# EAGLE design BBC_Male (EAGLE 9.5.1)
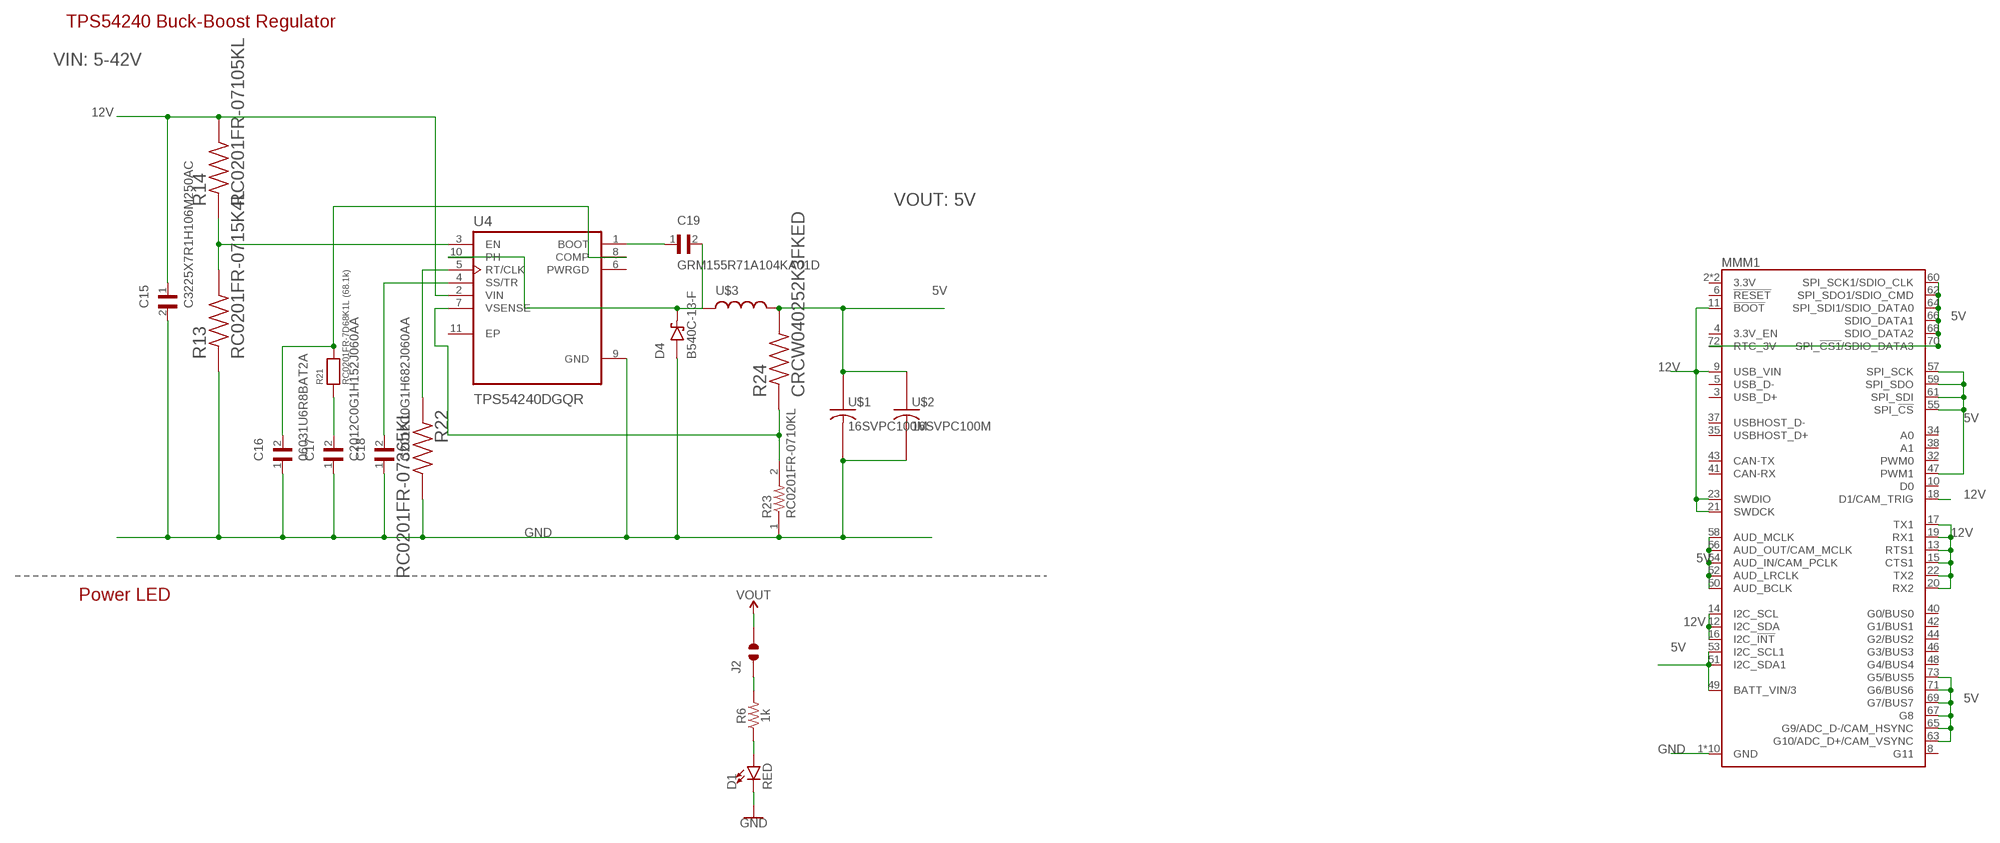
[diagram p0: schematic, sheet 1]

## Parts
C15  C3225X7R1H106M250AC  [CAPC3225X280N]
C16  06031U6R8BAT2A  [CAPC1507X91N]
C17  C2012C0G1H152J060AA  [CAPC2012X75N]
C18  C2012C0G1H682J060AA  [CAPC2012X75N]
C19  GRM155R71A104KA01D  [CAPC1005X55N]
D1  RED  LED-RED0603  [LED-0603]
D4  B540C-13-F  [DIOM6959X245N]
J2  JUMPER_SOLDER_1X2  [JUMPER_SOLDER_1X2]
MMM1  MICROMOD_4222_MALE  [MICROMOD_4222_MALE]
R6  1k  1KOHM-0603-1/10W-1%  [0603]
R13  RC0201FR-0715K4L  [RESC0603X26N]
R14  RC0201FR-07105KL  [RESC0603X26N]
R21  RC0201FR-7D68K1L (68.1k)  RESISTOR_0603  [_0603]
R22  RC0201FR-07365KL  [RESC0603X26N]
R23  RC0201FR-0710KL  [RESC0603X26N]
R24  CRCW040252K3FKED  [RESC1005X40N]
U4  TPS54240DGQR  [IC_XTR111AIDGQR]
U$1  16SVPC100M  [CAPAE0607X600N]
U$2  16SVPC100M  [CAPAE0607X600N]
U$3  MSS1260  [MSS1260]

## Nets
5V: J2.2 MMM1.47(PWM1) MMM1.49(BATT_VIN/3) MMM1.50(AUD_BCLK) MMM1.51(I2C_SDA1) MMM1.52(AUD_LRCLK) MMM1.53(I2C_SCL1) MMM1.54(AUD_IN/CAM_PCLK) MMM1.55(SPI_!CS!) MMM1.56(AUD_OUT/CAM_MCLK) MMM1.57(SPI_SCK) MMM1.58(AUD_MCLK) MMM1.59(SPI_SDO) MMM1.60(SPI_SCK1/SDIO_CLK) MMM1.61(SPI_SDI) MMM1.62(SPI_SDO1/SDIO_CMD) MMM1.63(G10/ADC_D+/CAM_VSYNC) MMM1.64(SPI_SDI1/SDIO_DATA0) MMM1.65(G9/ADC_D-/CAM_HSYNC) MMM1.66(SDIO_DATA1) MMM1.67(G8) MMM1.68(SDIO_DATA2) MMM1.69(G7/BUS7) MMM1.70(SPI_!CS1!/SDIO_DATA3) MMM1.71(G6/BUS6) MMM1.72(RTC_3V) MMM1.73(G5/BUS5) R24.2 U$1.+ U$2.+ U$3.P$1 ; supply symbol labelled VOUT
12V: C15.1 MMM1.9(USB_VIN) MMM1.11(!BOOT!) MMM1.12(I2C_SDA) MMM1.13(RTS1) MMM1.14(I2C_SCL) MMM1.15(CTS1) MMM1.16(I2C_!INT!) MMM1.17(TX1) MMM1.18(D1/CAM_TRIG) MMM1.19(RX1) MMM1.20(RX2) MMM1.21(SWDCK) MMM1.22(TX2) MMM1.23(SWDIO) R14.2 U4.2(VIN)
GND: C15.2 C16.1 C17.1 C18.1 D1.C D4.A MMM1.1(GND) MMM1.7(GND) MMM1.33(GND) MMM1.36(GND) MMM1.39(GND) MMM1.45(GND) MMM1.75(GND) MMM1.GND1(GND) MMM1.GND2(GND) MMM1.GND3(GND) R13.1 R22.2 R23.1 U4.9(GND) U$1.- U$2.-
N$8: J2.1 R6.2
N$9: D1.A R6.1
N$13: C19.1 U4.1(BOOT)
N$14: C17.2 R21.1
N$15: R13.2 R14.1 U4.3(EN)
N$16: C16.2 R21.2 U4.8(COMP)
N$17: R23.2 R24.1 U4.7(VSENSE)
N$18: C19.2 D4.C(K) U4.10(PH) U$3.P$2
N$19: C18.2 U4.4(SS/TR)
N$20: R22.1 U4.5(RT/CLK)
Unconnected: MMM1.2(3.3V) MMM1.3(USB_D+) MMM1.4(3.3V_EN) MMM1.5(USB_D-) MMM1.6(!RESET!) MMM1.8(G11) MMM1.10(D0) MMM1.32(PWM0) MMM1.34(A0) MMM1.35(USBHOST_D+) MMM1.37(USBHOST_D-) MMM1.38(A1) MMM1.40(G0/BUS0) MMM1.41(CAN-RX) MMM1.42(G1/BUS1) MMM1.43(CAN-TX) MMM1.44(G2/BUS2) MMM1.46(G3/BUS3) MMM1.48(G4/BUS4) MMM1.74(3.3V) U4.6(PWRGD) U4.11(EP)

## Notes on the sheet
- TPS54240 Buck-Boost Regulator
- VIN: 5-42V
- VOUT: 5V
- Power LED

## Library data of the parts
C15 = C3225X7R1H106M250AC:C3225X7R1H106M250AC: CAP CER 10UF 50V X7R 1210; DESCRIPTION: 10µF ±20% 50V Ceramic Capacitor X7R 1210 (3225 Metric); DIGI-KEY_PART_NUMBER: 445-14933-1-ND; MF: TDK; MP: C3225X7R1H106M250AC; PACKAGE: 1210 TDK; PURCHASE-URL: https://pricing.snapeda.com/search/part/C3225X7R1H106M250AC/?ref=eda
C16 = 06031U6R8BAT2A:06031U6R8BAT2A: CAP CER 6.8PF 100V NP0 0603; DESCRIPTION: 6.8pF ±0.1pF 100V Ceramic Capacitor C0G, NP0 0603 (1608 Metric); DIGI-KEY_PART_NUMBER: 478-06031U6R8BAT2ACT-ND; MF: AVX; MP: 06031U6R8BAT2A; PACKAGE: 1507 AVX; PURCHASE-URL: https://pricing.snapeda.com/search/part/06031U6R8BAT2A/?ref=eda
C17 = C2012C0G1H152J060AA:C2012C0G1H152J060AA: CERAMIC CAPACITOR 1500PF 50V, C0G, 5%, 0805; DESCRIPTION: 1500pF ±5% 50V Ceramic Capacitor C0G, NP0 0805 (2012 Metric); MF: TDK; MP: C2012C0G1H152J060AA; PACKAGE: 2012 TDK; PURCHASE-URL: https://pricing.snapeda.com/search/part/C2012C0G1H152J060AA/?ref=eda
C18 = C2012C0G1H682J060AA:C2012C0G1H682J060AA: Cap Ceramic 0.0068uF 50V C0G 5% Pad SMD 0805 125C T/R; AVAILABILITY: Unavailable; DESCRIPTION: 6800pF ±5% 50V Ceramic Capacitor C0G, NP0 0805 (2012 Metric); MF: TDK; MP: C2012C0G1H682J060AA; PACKAGE: 2012 TDK; PRICE: None
C19 = GRM155R71A104KA01D:GRM155R71A104KA01D; DESCRIPTION: SMD Capacitor X7R(EIA) with Capacitance: 0.10uF Tol. 10%. Rated Voltage: 10Vdc; DIGI-KEY_PART_NUMBER: 490-6321-1-ND; MF: Murata; MP: GRM155R71A104KA01D; PACKAGE: 1005 Taiyo Yuden; PURCHASE-URL: https://pricing.snapeda.com/search/part/GRM155R71A104KA01D/?ref=eda
D1 = SparkFun-LED:LED-RED: Assorted Red LEDs LilyPad 1206- DIO-09912 1206- DIO-00809 0603- DIO-00819 "SMART" means more efficient and expensive; PROD_ID: DIO-00819
D4 = B540C-13-F:B540C-13-F: Diode, Schottky, 5a, 40v, Do-214ab-2, Full Reel Check prices <https://pricing.snapeda.com/parts/B540C-13-F/Diodes%20Inc./view-part?ref=eda>; AVAILABILITY: Good; DESCRIPTION: Diode Schottky 40V 5A Surface Mount SMC; MF: Diodes Inc.; MP: B540C-13-F; PACKAGE: DO-214 Diodes Inc.; PRICE: None; PURCHASE-URL: https://pricing.snapeda.com/search/part/B540C-13-F/?ref=eda
J2 = dp_devices:JUMPER_SOLDER_1X2
MMM1 = Micromod_4222_Male:MICROMOD_4222_MALE
R6 = SparkFun-Resistors:1KOHM: 1kΩ resistor A resistor is a passive two-terminal electrical component that implements electrical resistance as a circuit element. Resistors act to reduce current flow, and, at the same time, act to lower voltage levels within circuits. - Wikipedia; PROD_ID: RES-07856
R13 = RC0201FR-0715K4L:RC0201FR-0715K4L: RC Series 0201 0.05 W 15.4 kOhms 1% ±200 ppm/°C SMT Thick Film Chip Resistor Check prices <https://pricing.snapeda.com/parts/RC0201FR-0715K4L/Yageo/view-part?ref=eda>; AVAILABILITY: Warning; DESCRIPTION: 15.4 kOhms ±1% 0.05W, 1/20W Chip Resistor 0201 (0603 Metric) Thick Film; MF: Yageo; MP: RC0201FR-0715K4L; PACKAGE: 0603 Rohm Semiconductor; PRICE: None
R14 = RC0201FR-07105KL:RC0201FR-07105KL: Res Thick Film 0201 105K Ohm 1% 1/20W ±200ppm/°C Molded SMD Paper T/R; DESCRIPTION: 105 kOhms ±1% 0.05W, 1/20W Chip Resistor 0201 (0603 Metric) Thick Film; DIGI-KEY_PART_NUMBER: 311-105KMCT-ND; MF: Yageo; MP: RC0201FR-07105KL; PACKAGE: 0603 Rohm Semiconductor
R21 = microbuilder:RESISTOR: Resistors 0402 - 0402 Surface Mount Package 22 Ohm 1% 1/16W [Digikey: 311-22.0LRTR-ND] 33 Ohm 5% 1/16W 1.0K 5% 1/16W 1.5K 5% 1/16W 2.0K 1% 1/16W 10.0K 1% 1/16W [Digikey: 311-10.0KLRTR-ND] 10.0K 5% 1/16W [Digikey: RMCF0402JT10K0TR-ND] 12.1K 1% 1/16W [Digikey: 311-22.0LRTR-ND] 100.0K 5% 1/16W 0603 - 0603 Surface Mount Package 0 Ohm 1/10 Watt 1% Resistor 15 Ohm 1/10 Watt 1% Resistor 33 Ohm 1/10 Watt 1% Resistor 49.9 Ohm 1/10 Watt 1% Resistor 100 Ohm 1/10 Watt 1% Resistor 150 Ohm 1/10 Watt 1% Resistor 240 Ohm 1/10 Watt 1% Resistor 390 Ohm 1/10 Watt 1% Resistor 560 Ohm 1/10 Watt 1% Resistor 680 Ohm 1/10 Watt 1% Resistor 750 Ohm 1/10 Watt 1% Resistor 1.0K Ohm 1/10 Watt 1% Resistor 1.5K Ohm 1/10 Watt 1% Resistor 2.0K Ohm 1/10 Watt 1% Resistor 2.2K Ohm 1/10 Watt 1% Resistor 3.3K Ohm 1/10 Watt 1% Resistor 4.7K Ohm 1/10 Watt 1% Resistor 10.0K Ohm 1/10 Watt 1% Resistor 12.0K Ohm 1/10 Watt 1% Resistor 12.1K Ohm 1/10 Watt 1% Resistor 20.0K Ohm 1/10 Watt 1% Resistor 33.0K Ohm 1/10 Watt 1% Resistor 100.0K Ohm 1/10 Watt 1% Resistor 0805 - 0805 Surface Mount Package 0 Ohm 1/8 Watt 1% Resistor 33 Ohm 1/8 Watt 1% Resistor 100 Ohm 1/8 Watt 1% Resistor 150 Ohm 1/8 Watt 1% Resistor 200 Ohm 1/8 Watt 1% Resistor 240 Ohm 1/8 Watt 1% Resistor 330 Ohm 1/8 Watt 1% Resistor 390 Ohm 1/8 Watt 1% Resistor 470 Ohm 1/8 Watt 1% Resistor 1.0K Ohm 1/8 Watt 1% Resistor 1.5K Ohm 1/8 Watt 1% Resistor 2.0K Ohm 1/8 Watt 1% Resistor 4.7K Ohm 1/8 Watt 1% Resistor 5.1K Ohm 1/8 Watt 1% Resistor 5.6K Ohm 1/8 Watt 1% Resistor 10.0K Ohm 1/8 Watt 1% Resistor 22.0K Ohm 1/8 Watt 1% Resistor 33.0K Ohm 1/8 Watt 1% Resistor 100K Ohm 1/8 Watt 1% Resistor 1206 - 1206 Surface Mount Package 2012 - 2010 Surface Mount Package 0.11 Ohm 1/2 Watt 1% Resistor - Digikey: RHM.11UCT-ND
R22 = RC0201FR-07365KL:RC0201FR-07365KL: RES SMD 365K OHM 1% 1/20W 0201; DESCRIPTION: 365 kOhms ±1% 0.05W, 1/20W Chip Resistor 0201 (0603 Metric) Moisture Resistant Thick Film; DIGI-KEY_PART_NUMBER: YAG2623CT-ND; MF: Yageo; MP: RC0201FR-07365KL; PACKAGE: 0603 Rohm Semiconductor; PURCHASE-URL: https://pricing.snapeda.com/search/part/RC0201FR-07365KL/?ref=eda
R23 = RC0201FR-0710KL:RC0201FR-0710KL: RC0201 10,0K 1% 0,05W TK200; DESCRIPTION: 10 kOhms ±1% 0.05W, 1/20W Chip Resistor 0201 (0603 Metric) Thick Film; DIGI-KEY_PART_NUMBER: 311-10.0KMCT-ND; MF: Yageo; MP: RC0201FR-0710KL; PACKAGE: 0201 Yageo; PURCHASE-URL: https://pricing.snapeda.com/search/part/RC0201FR-0710KL/?ref=eda
R24 = CRCW040252K3FKED:CRCW040252K3FKED: D10/Crcw0402 100 52K3 1% Et7 E3 Check prices <https://pricing.snapeda.com/parts/CRCW040252K3FKED/Vishay%20Dale/view-part?ref=eda>; AVAILABILITY: Warning; DESCRIPTION: Res Thick Film 0402 52.3K Ohm 1% 0.063W(1/16W) ±100ppm/C Molded SMD Automotive Paper T/R; MF: Vishay Dale; MP: CRCW040252K3FKED; PACKAGE: 1005 Panasonic Electronic Components; PRICE: None; PURCHASE-URL: https://pricing.snapeda.com/search/part/CRCW040252K3FKED/?ref=eda
U4 = TPS54240DGQR:TPS54240DGQR: Check prices <https://pricing.snapeda.com/parts/TPS54240DGQR/Texas%20Instruments/view-part?ref=eda>; AVAILABILITY: Good; DESCRIPTION: 3.5V to 42V Input, 2.5A Step-Down Converter with Eco-Mode 10-HVSSOP -40 to 125; MF: Texas Instruments; MP: TPS54240DGQR; PACKAGE: HVSSOP-10 Texas Instruments; PRICE: None; PURCHASE-URL: https://pricing.snapeda.com/search/part/TPS54240DGQR/?ref=eda
U$1 U$2 = 16SVPC100M:16SVPC100M: CAP POLYMER 100UF 20% 16V SMD; DESCRIPTION: 100µF 16V Aluminum - Polymer Capacitors Radial, Can - SMD 24mOhm 2000 Hrs @ 105°C; DIGI-KEY_PART_NUMBER: P16468CT-ND; MF: Panasonic; MP: 16SVPC100M; PACKAGE: Radial Panasonic; PURCHASE-URL: https://pricing.snapeda.com/search/part/16SVPC100M/?ref=eda
U$3 = inductor-coilcraft (1):MSS1260: SMT Power Inductor

## Board
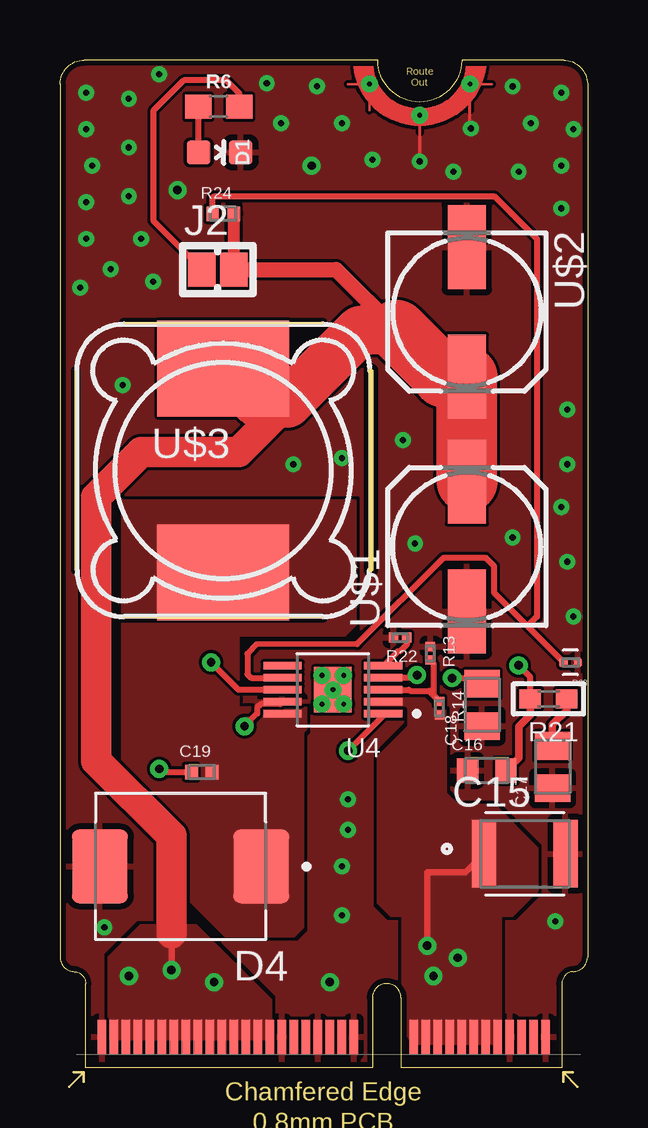
[diagram p1: board, top side]
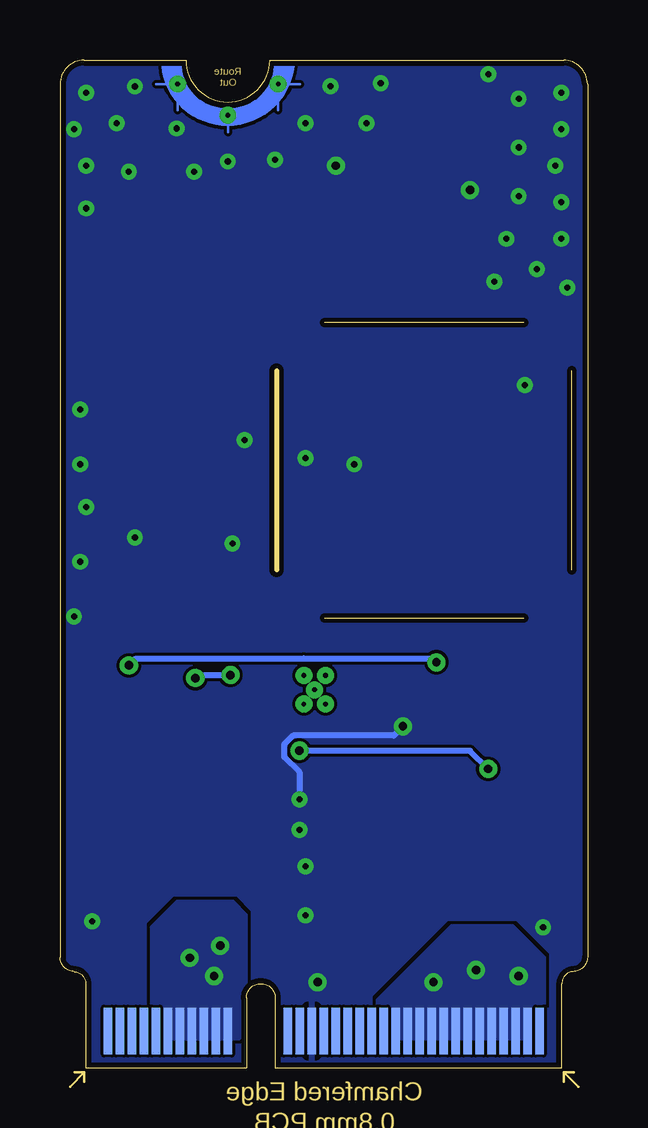
[diagram p2: board, bottom side, seen from below]

Size 22 x 42 mm. Coordinates in mm from the lower left corner, seen from the top.
Copper layers (1*16): Top 0.075mm / dielectric 1.6mm / Bottom 0.075mm
Design rules "jlcpcb-2layers *": minimum track width 8mil, minimum drill 0.2mm, track to track 5mil, track to pad 5mil, pad to pad 5mil, via to via 5mil, smd to smd 5mil, copper to edge 0.2mm, drill to drill 6mil, minimum pad ring 10mil, minimum via ring 8mil, stop-mask expansion 3mil, vias tented up to drill 0mil, thermal gap 10mil

### Footprints (pad centres in the part's own frame; a part is rotated, then mirrored left to right if it is on the bottom)
CAPC3225X280N = smd 1.01 x 2.81: 1 -1.7,0; 2 1.7,0
CAPC1507X91N = smd 0.89 x 1.02: 1 -0.796,0; 2 0.796,0
CAPC2012X75N = smd 1.15 x 1.47: 1 -0.88,0; 2 0.88,0
CAPC1005X55N = smd 0.54 x 0.6: 1 -0.432,0; 2 0.432,0
LED-0603 = smd 1 x 1: A 0,-0.877; C 0,0.877
DIOM6959X245N = smd 2.33 x 3.07: A 3.365,0; C -3.365,0
JUMPER_SOLDER_1X2 = smd 1.143 x 1.422: 1 -0.66,0; 2 0.66,0
MICROMOD_4222_MALE = smd 0.35 x 1.45: 1 9.25,1.275; 3 8.75,1.275; 5 8.25,1.275; 7 7.75,1.275; 9 7.25,1.275; 11 6.75,1.275; 13 6.25,1.275; 15 5.75,1.275; 17 5.25,1.275; 19 4.75,1.275; 21 4.25,1.275; 23 3.75,1.275; 33 1.25,1.275; 35 0.75,1.275; 37 0.25,1.275; 39 -0.25,1.275; 41 -0.75,1.275; 43 -1.25,1.275; 45 -1.75,1.275; 47 -2.25,1.275; 49 -2.75,1.275; 51 -3.25,1.275; 53 -3.75,1.275; 55 -4.25,1.275; 57 -4.75,1.275; 59 -5.25,1.275; 61 -5.75,1.275; 63 -6.25,1.275; 65 -6.75,1.275; 67 -7.25,1.275; 69 -7.75,1.275; 71 -8.25,1.275; 73 -8.75,1.275; 75 -9.25,1.275 | smd 0.35 x 1.95 bottom: 2 9,1.525; 4 8.5,1.525; 6 8,1.525; 8 7.5,1.525; 10 7,1.525; 12 6.5,1.525; 14 6,1.525; 16 5.5,1.525; 18 5,1.525; 20 4.5,1.525; 22 4,1.525; 32 1.5,1.525; 34 1,1.525; 36 0.5,1.525; 38 0,1.525; 40 -0.5,1.525; 42 -1,1.525; 44 -1.5,1.525; 46 -2,1.525; 48 -2.5,1.525; 50 -3,1.525; 52 -3.5,1.525; 54 -4,1.525; 56 -4.5,1.525; 58 -5,1.525; 60 -5.5,1.525; 62 -6,1.525; 64 -6.5,1.525; 66 -7,1.525; 68 -7.5,1.525; 70 -8,1.525; 72 -8.5,1.525; 74 -9,1.525 | drill 0.2: GND1 1.9,41; GND2 4,39.7; GND3 6.1,41
0603 = smd 1.1 x 1: 1 -0.85,0; 2 0.85,0
RESC0603X26N = smd 0.38 x 0.4: 1 -0.281,0; 2 0.281,0
_0603 = smd 0.9 x 0.8: 1 -0.762,0; 2 0.762,0
RESC0603X26N' = smd 0.33 x 0.4: 1 -0.305,0 | smd 0.38 x 0.4: 2 0.28,0
RESC1005X40N = smd 0.51 x 0.6: 1 -0.445,0; 2 0.445,0
IC_XTR111AIDGQR = smd 1.6 x 0.3: 1 -2.1,1; 2 -2.1,0.5; 3 -2.1,0; 4 -2.1,-0.5; 5 -2.1,-1; 6 2.1,-1; 7 2.1,-0.5; 8 2.1,0; 9 2.1,0.5; 10 2.1,1 | smd 1.57 x 1.88: 11 0,0 | drill 0.2 pad 0.4: 12 -0.45,0.6; 13 0.45,0.6; 14 0,0; 15 -0.45,-0.6; 16 0.45,-0.6
CAPAE0607X600N = smd 3.5 x 1.6: + 2.7,0; - -2.7,0
MSS1260 = smd 5.5 x 4: P$1 0,4.25; P$2 0,-4.25

### Placement (x,y rotation side)
C15  19.38,8.91 0 top
C16  17.8,12.38 0 top
C17  20.54,12.53 90 top
C18  17.6,15.11 90 top
C19  5.92,12.32 0 top
D1  6.66,38.15 270 top
D4  5.03,8.38 180 top
J2  6.58,33.27 0 top
MMM1  11,0 0 top
R6  6.62,40.05 0 top
R13  15.45,17.27 270 top
R14  15.83,14.99 270 top
R21  20.37,15.37 180 top
R22  14.18,17.93 180 top
R23  RC0201FR-0710KL  [RESC0603X26N']  21.29,16.89 180 top
R24  6.81,35.59 0 top
U4  11.38,15.75 180 top
U$1  16.97,21.72 90 top
U$2  16.97,31.5 270 top
U$3  6.81,24.89 0 top

### Tracks (layer width: path | path; a pad name or v marks a point on that pad's centre or on a via)
5V  (via drill 0.35)
  Top 0.279: 4.65,5.59 v4.65,4.06
  Top 0.508: R24.2 J2.2
  Top 0.635: J2.2 11.51,33.27 14.05,30.73
  Top 1.27: 9.48,27.69 7.44,25.65 3.38,25.65 1.52,23.79 1.52,12.79 4.65,9.65 4.65,5.59
  Top 2.032: 14.05,30.73 12.52,30.73 9.48,27.69 8.26,27.69 U$3.P$1
  Top 2.54: 14.05,30.73 15.99,28.8 U$2.+ U$1.+
  other vias: 6.43,3.56 2.87,3.81
  pour Top (no thermals): 2.11,1.27 8.71,1.27 8.71,2.79 5.67,5.84 3.38,5.84 2.11,4.57
  pour Bottom (no thermals): 3.13,5.84 5.67,5.84 8.97,2.54 8.97,1.27 1.86,1.27 1.86,4.57
12V  (via drill 0.35)
  Top 0.279: C15.1 16.9,8.13 15.32,8.13 v15.32,5.08
  other vias: 16.59,4.57 15.57,3.81
  pour Top (no thermals): 13.03,15.37 15.19,15.37 16.08,14.48 16.08,11.43 16.59,10.92 18.11,10.92 19.89,9.14 19.89,7.37 18.87,6.35 13.79,6.35 13.29,6.86 13.29,12.95 14.56,14.22 14.56,14.99 14.43,15.11 13.03,15.11
  pour Top (no thermals): 16.08,14.35 16.08,14.86 15.57,14.86 15.57,14.35
  pour Top (no thermals): 14.3,6.86 14.3,1.52 14.81,1.02 18.11,1.02 18.37,1.27 18.37,6.86
  pour Bottom (no thermals): 14.3,6.35 14.3,1.52 14.56,1.27 18.11,1.27 18.11,5.84 17.1,6.86 14.81,6.86
GND  (via drill 0.25, 0.35)
  Top 0.127: MMM1.GND2 v15,37.77 | 17.1,39.18 MMM1.GND3
  Top 0.203: MMM1.GND2 | v17.13,39.14 17.1,39.18
  Top 0.254: U4.9 9.18,15.15 8.38,15.15 8.23,15 8.23,14.75 v7.7,14.22
  Bottom 0.254: v7.7,14.22 8.08,13.84 12.28,13.84 12.65,13.47 12.65,12.95 12.02,12.31 v12.02,11.18
  other vias: 20.91,40.64 21.41,39.12 20.91,37.59 20.91,35.81 18.87,40.89 19.64,39.37 19.13,37.34 16.41,37.35 13.03,37.85 11.76,39.37 10.72,40.91 9.22,39.37 8.62,41.03 4.14,41.4 2.87,40.39 2.87,38.35 1.09,39.12 1.09,40.64 2.87,36.32 3.38,34.54 3.89,32.77 1.35,37.59 1.09,36.07 1.09,34.54 2.11,33.27 0.84,32.51 21.16,27.43 21.16,25.15 14.3,26.16 11.76,25.4 14.81,21.84 18.87,22.1 12.02,9.91 11.76,8.38 11.76,6.35 9.73,25.15 2.62,28.45 20.91,23.37 21.16,21.08 21.41,18.8 20.65,6.1 1.86,5.84 10.49,37.59 4.9,36.58 11.25,3.56
  pour Top (rank 2): -0.43,42.42 22.43,42.42 22.43,-0.51 -0.43,-0.51
  pour Bottom (rank 2): -0.43,42.42 22.43,42.42 22.43,-0.51 -0.43,-0.51
N$8
  Top 0.254: R6.2 7.47,40.61 6.94,41.15 5.16,41.15 3.89,39.88 3.89,35.3 J2.1
N$9
  Top 0.254: D1.A R6.1
N$13  (via drill 0.35)
  Top 0.254: v4.14,12.45 4.27,12.32 C19.1 | v12.02,13.21 13.48,14.67 U4.1
  Bottom 0.254: v4.14,12.45 4.9,13.21 v12.02,13.21
N$14
  Top 0.305: R21.1 21.13,14.89 20.54,14.3 C17.2
N$15
  Top 0.254: R13.2 15.57,16.86 15.57,15.52 R14.1 15.39,15.7 14.59,15.7 14.54,15.75 U4.3
N$16  (via drill 0.35)
  Top 0.254: R21.2 19.61,16.28 v19.13,16.76 | U4.8 7.44,15.75 v6.3,16.89
  Top 0.305: R21.2 19.61,14.7 19.13,14.22 19.13,12.91 C16.2
  Bottom 0.254: v19.13,16.76 18.84,17.05 11.85,17.05 11.84,17.06 6.47,17.06 v6.3,16.89
N$17
  Top 0.254: U4.7 7.96,16.25 7.81,16.39 7.81,17.25 8.2,17.64 12.39,17.65 15.99,21.25 17.76,21.25 18.11,20.89 18.11,19.79 19.5,18.4 | R23.2 19.5,18.4 | 19.5,18.4 19.89,18.8 19.89,34.54 18.11,36.32 6.43,36.32 6.36,36.26 R24.1
N$18
  pour Top (no thermals): 10.24,14.99 7.44,14.99 7.44,18.03 7.44,18.03 11.89,18.03 12.3,18.44 12.3,23.62 2.62,23.62 2.62,9.78 6.91,5.49 9.76,5.49 10.11,5.84 10.11,13.97 10.24,14.1
N$19  (via drill 0.35)
  Top 0.254: U4.4 13.49,16.26 14.89,16.26 v14.89,16.36 | v16.36,16.23 17.36,16.23 C18.2
  Bottom 0.254: v16.36,16.23 16.23,16.36 v14.89,16.36
N$20
  Top 0.254: U4.5 14.08,17.35 14.18,17.35 14.46,17.63 R22.1

### Text on the board
tDocu: - 2oz Copper!